# EAGLE design EAGLE_PCB_Design_Project1.2_DavidSalzmann (EAGLE 9.6.2)
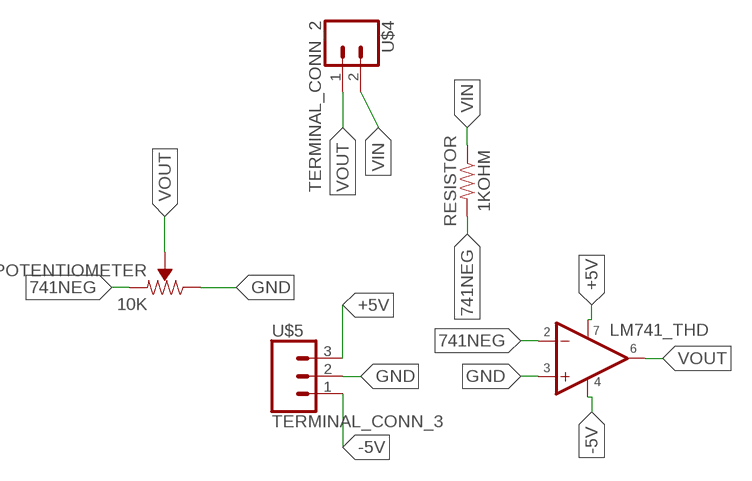
[diagram p0: schematic, sheet 1]

## Parts
1KOHM  RESISTOR  [RESISTOR]
10K  POTENTIOMETER  [POTENTIOMETER]
U$1  IC-LM741  [IC-LM741]
U$4  TERMINAL_CONN_2  [TERMINAL_CONN_2]
U$5  TERMINAL_CONN_3  [TERMINAL-CONN_3]

## Nets
741NEG: 1KOHM.2 10K.3(CCW) U$1.2(-IN)
+5V: U$1.7 U$5.3
-5V: U$1.4 U$5.1
GND: 10K.2(CW) U$1.3(+IN) U$5.2
VIN: 1KOHM.1 U$4.2
VOUT: 10K.1(WIPER) U$1.6(OUT) U$4.1

## Library data of the parts
1KOHM = ECE5_WS:RESISTOR: This is a resistor
10K = ECE5_WS:POTENTIOMETER: This is a potentiometer
U$1 = ECE5_WS:IC-LM741: This is an IC (Integrated Circuit) LM741 in lab2
U$4 = ECE5_WS:TERMINAL_CONN_2: 2 pin terminal block
U$5 = ECE5_WS:TERMINAL_CONN_3: This is a 3 pin terminal block

## Board
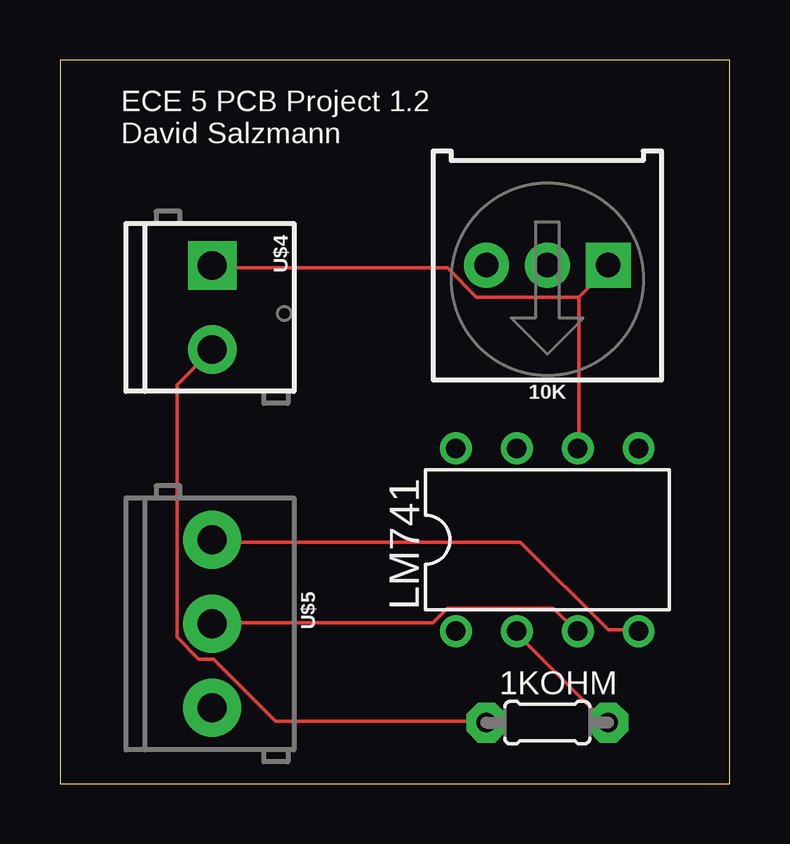
[diagram p1: board, top side]
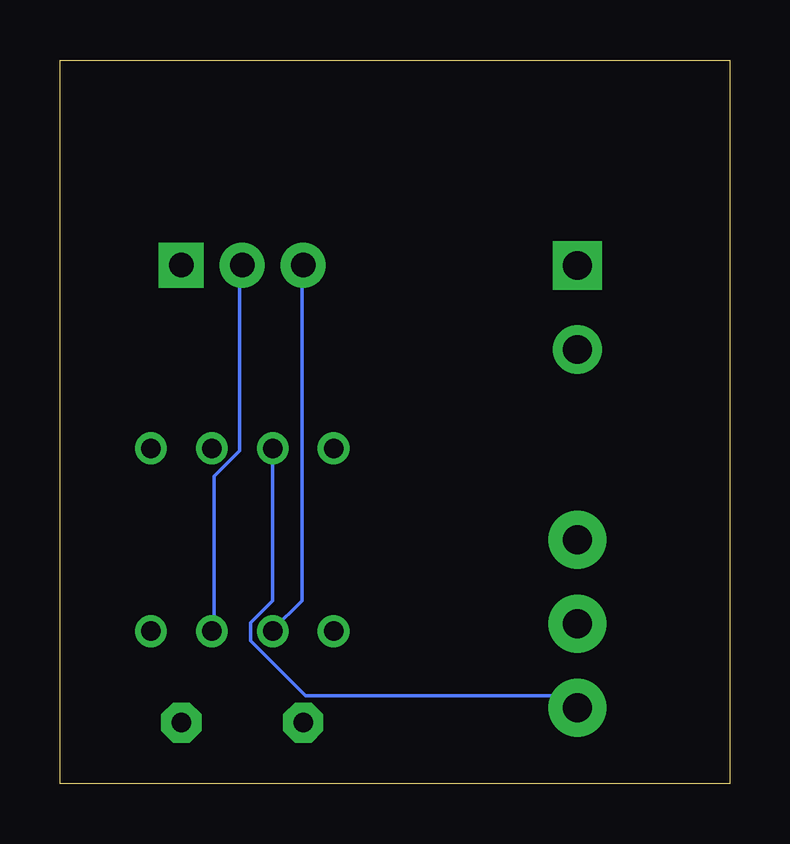
[diagram p2: board, bottom side, seen from below]

Size 27.92 x 30.15 mm. Coordinates in mm from the lower left corner, seen from the top.
Outline: 0,0 27.92,0 27.92,30.15 0,30.15 0,0
Copper layers (1*16): Top 0.035mm / dielectric 1.5mm / Bottom 0.035mm
Design rules "default": minimum track width 6mil, minimum drill 0.35mm, track to track 6mil, track to pad 6mil, pad to pad 6mil, via to via 6mil, smd to smd 6mil, copper to edge 40mil, drill to drill 6mil, minimum pad ring 10mil, minimum via ring 8mil, stop-mask expansion 4mil, vias tented up to drill 0mil, thermal gap 10mil

### Footprints (pad centres in the part's own frame; a part is rotated, then mirrored left to right if it is on the bottom)
RESISTOR = drill 0.813 pad 1.676 octagon: 1 -2.54,0; 2 2.54,0
POTENTIOMETER = drill 1.016 pad 1.88 square: 1 -2.54,-0.015 | drill 1.016 pad 1.88: 2 0,-0.015; 3 2.54,-0.015
IC-LM741 = drill 0.813 pad 1.27: 1 -3.81,-3.81; 2 -1.27,-3.81; 3 1.27,-3.81; 4 3.81,-3.81; 5 3.81,3.81; 6 1.27,3.81; 7 -1.27,3.81; 8 -3.81,3.81
TERMINAL_CONN_2 = drill 1.2 pad 2.032 square: 1 0,0 | drill 1.2 pad 2.032: 2 3.5,0
TERMINAL-CONN_3 = drill 1.2 pad 2.413: 1 0,0; 2 3.5,0; 3 7,0

### Placement (x,y rotation side)
1KOHM  20.32,2.54 0 top
10K  20.32,21.59 180 top
U$1  20.32,10.16 0 top
U$4  6.35,21.59 270 top
U$5  6.35,10.16 270 top

### Tracks (layer width: path | path; a pad name or v marks a point on that pad's centre or on a via)
741NEG
  Top 0.152: U$1.2 19.05,6.25 22.86,2.44 1KOHM.2
  Bottom 0.152: 10K.3 17.83,21.49 17.83,7.62 19.05,6.4 U$1.2
+5V
  Bottom 0.152: U$1.7 19.05,7.62 19.96,6.71 19.96,5.94 17.68,3.66 6.86,3.66 6.4,3.2 U$5.3
-5V
  Top 0.152: U$1.4 24.08,6.4 22.86,6.4 19.2,10.06 6.4,10.06 U$5.1
GND
  Top 0.152: U$5.2 6.4,6.71 15.54,6.71 16.15,7.32 20.57,7.32 21.49,6.4 U$1.3
  Bottom 0.152: U$1.3 21.49,6.4 21.49,12.8 20.42,13.87 20.42,21.49 10K.2
VIN
  Top 0.152: 1KOHM.1 17.68,2.59 8.99,2.59 6.4,5.18 5.79,5.18 4.88,6.1 4.88,16.61 6.25,17.98 U$4.2
VOUT
  Top 0.152: 21.64,20.27 21.64,14.02 U$1.6 | 21.64,20.27 22.86,21.49 10K.1 | 21.64,20.27 17.37,20.27 16.15,21.49 6.4,21.49 U$4.1

### Text on the board
tPlace: ECE 5 PCB Project 1.2 / David Salzmann